# Altium schematic sheet power.SchDoc
size A4
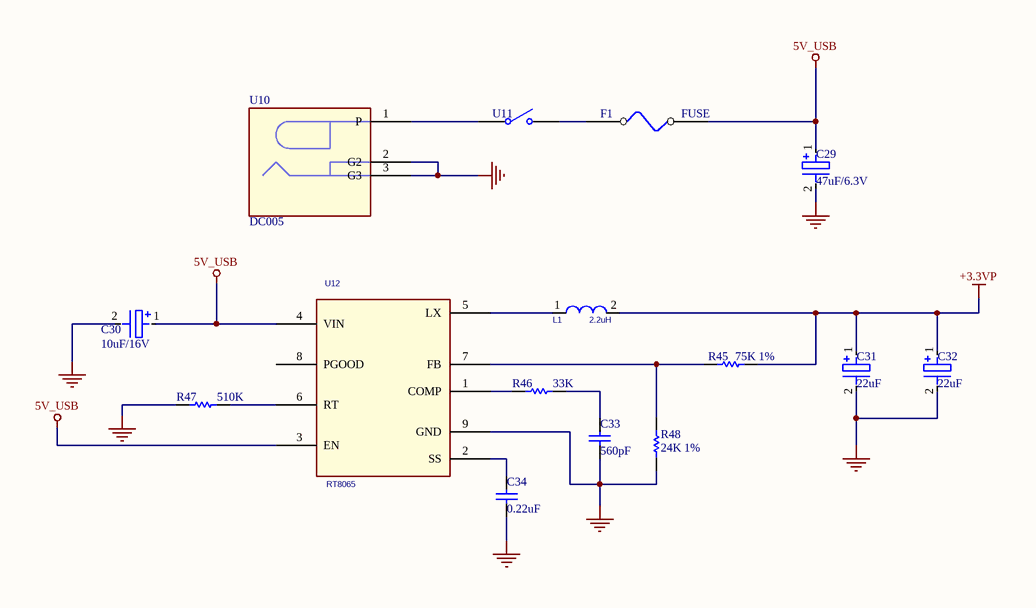
[diagram p0: power.SchDoc]

## Parts
C29  value 47uF/6.3V  [C0805L]  (hidden comment: Cap)
C30  value 10uF/16V  [C0603L]  (hidden comment: Cap)
C31  value 22uF  [C0805L]  (hidden comment: Cap)
C32  value 22uF  [C0805L]  (hidden comment: Cap)
C33  value 560pF  [C0603L]  (hidden comment: Cap Semi)
C34  value 0.22uF  [C0603L]  (hidden comment: Cap Semi)
F1  FUSE  [FS_1206]
L1  2.2uH  [L3X3MM]
R45  value 75K 1%  [R0603L]  (hidden comment: Res Semi)
R46  value 33K  [R0603L]  (hidden comment: Res Semi)
R47  value 510K  [R0603L]  (hidden comment: Res Semi)
R48  value 24K 1%  [R0603L]  (hidden comment: Res Semi)
U10  DC005  [DC005]
U11  switch_on_off  [switch_bodong]  (value not drawn)
U12  RT8065  [soic8-lh]

## Nets
5V_USB: C29.1 C30.1 F1.2 U12.3(EN) U12.4(VIN)
+3.3VP: C31.1 C32.1 L1.2 R45.2
GND: C29.2 C30.2 C31.2 C32.2 C33.2 C34.2 R47.2 R48.2 U10.2(G2) U10.3(G3) U12.9(GND)
NetC33_1: C33.1 R46.1
NetC34_1: C34.1 U12.2(SS)
NetF1_1: F1.1 U11.2(NO)
NetL1_1: L1.1 U12.5(LX)
NetR45_1: R45.1 R48.1 U12.7(FB)
NetR46_2: R46.2 U12.1(COMP)
NetR47_1: R47.1 U12.6(RT)
NetU10_1: U10.1(P) U11.1(COMMON)

Not connected (* = marked no-connect by the designer): U12 8(PGOOD)

## Library data of the parts
C29-C32 = CAP3
C33 C34 = Cap Semi: Capacitor (Semiconductor SIM Model); Published: 8-Jun-2000; LatestRevisionDate: 17-Jul-2002; LatestRevisionNote: Re-released for DXP Platform.; PackageReference: C1206; Publisher: Altium Limited
L1 = LQH32C_0_Dup1
R45-R48 = Res Semi: Semiconductor Resistor; Published: 8-Jun-2000; LatestRevisionDate: 17-Jul-2002; LatestRevisionNote: Re-released for DXP Platform.; PackageReference: AXIAL-0.5; Publisher: Altium Limited